# EasyEDA schematic ESP_SCH.json
TITLE: DRONE_ESP_SHIELD; REV: 0.2; Date: 2023-10-10; Sheet: 1/1; Company: QUB
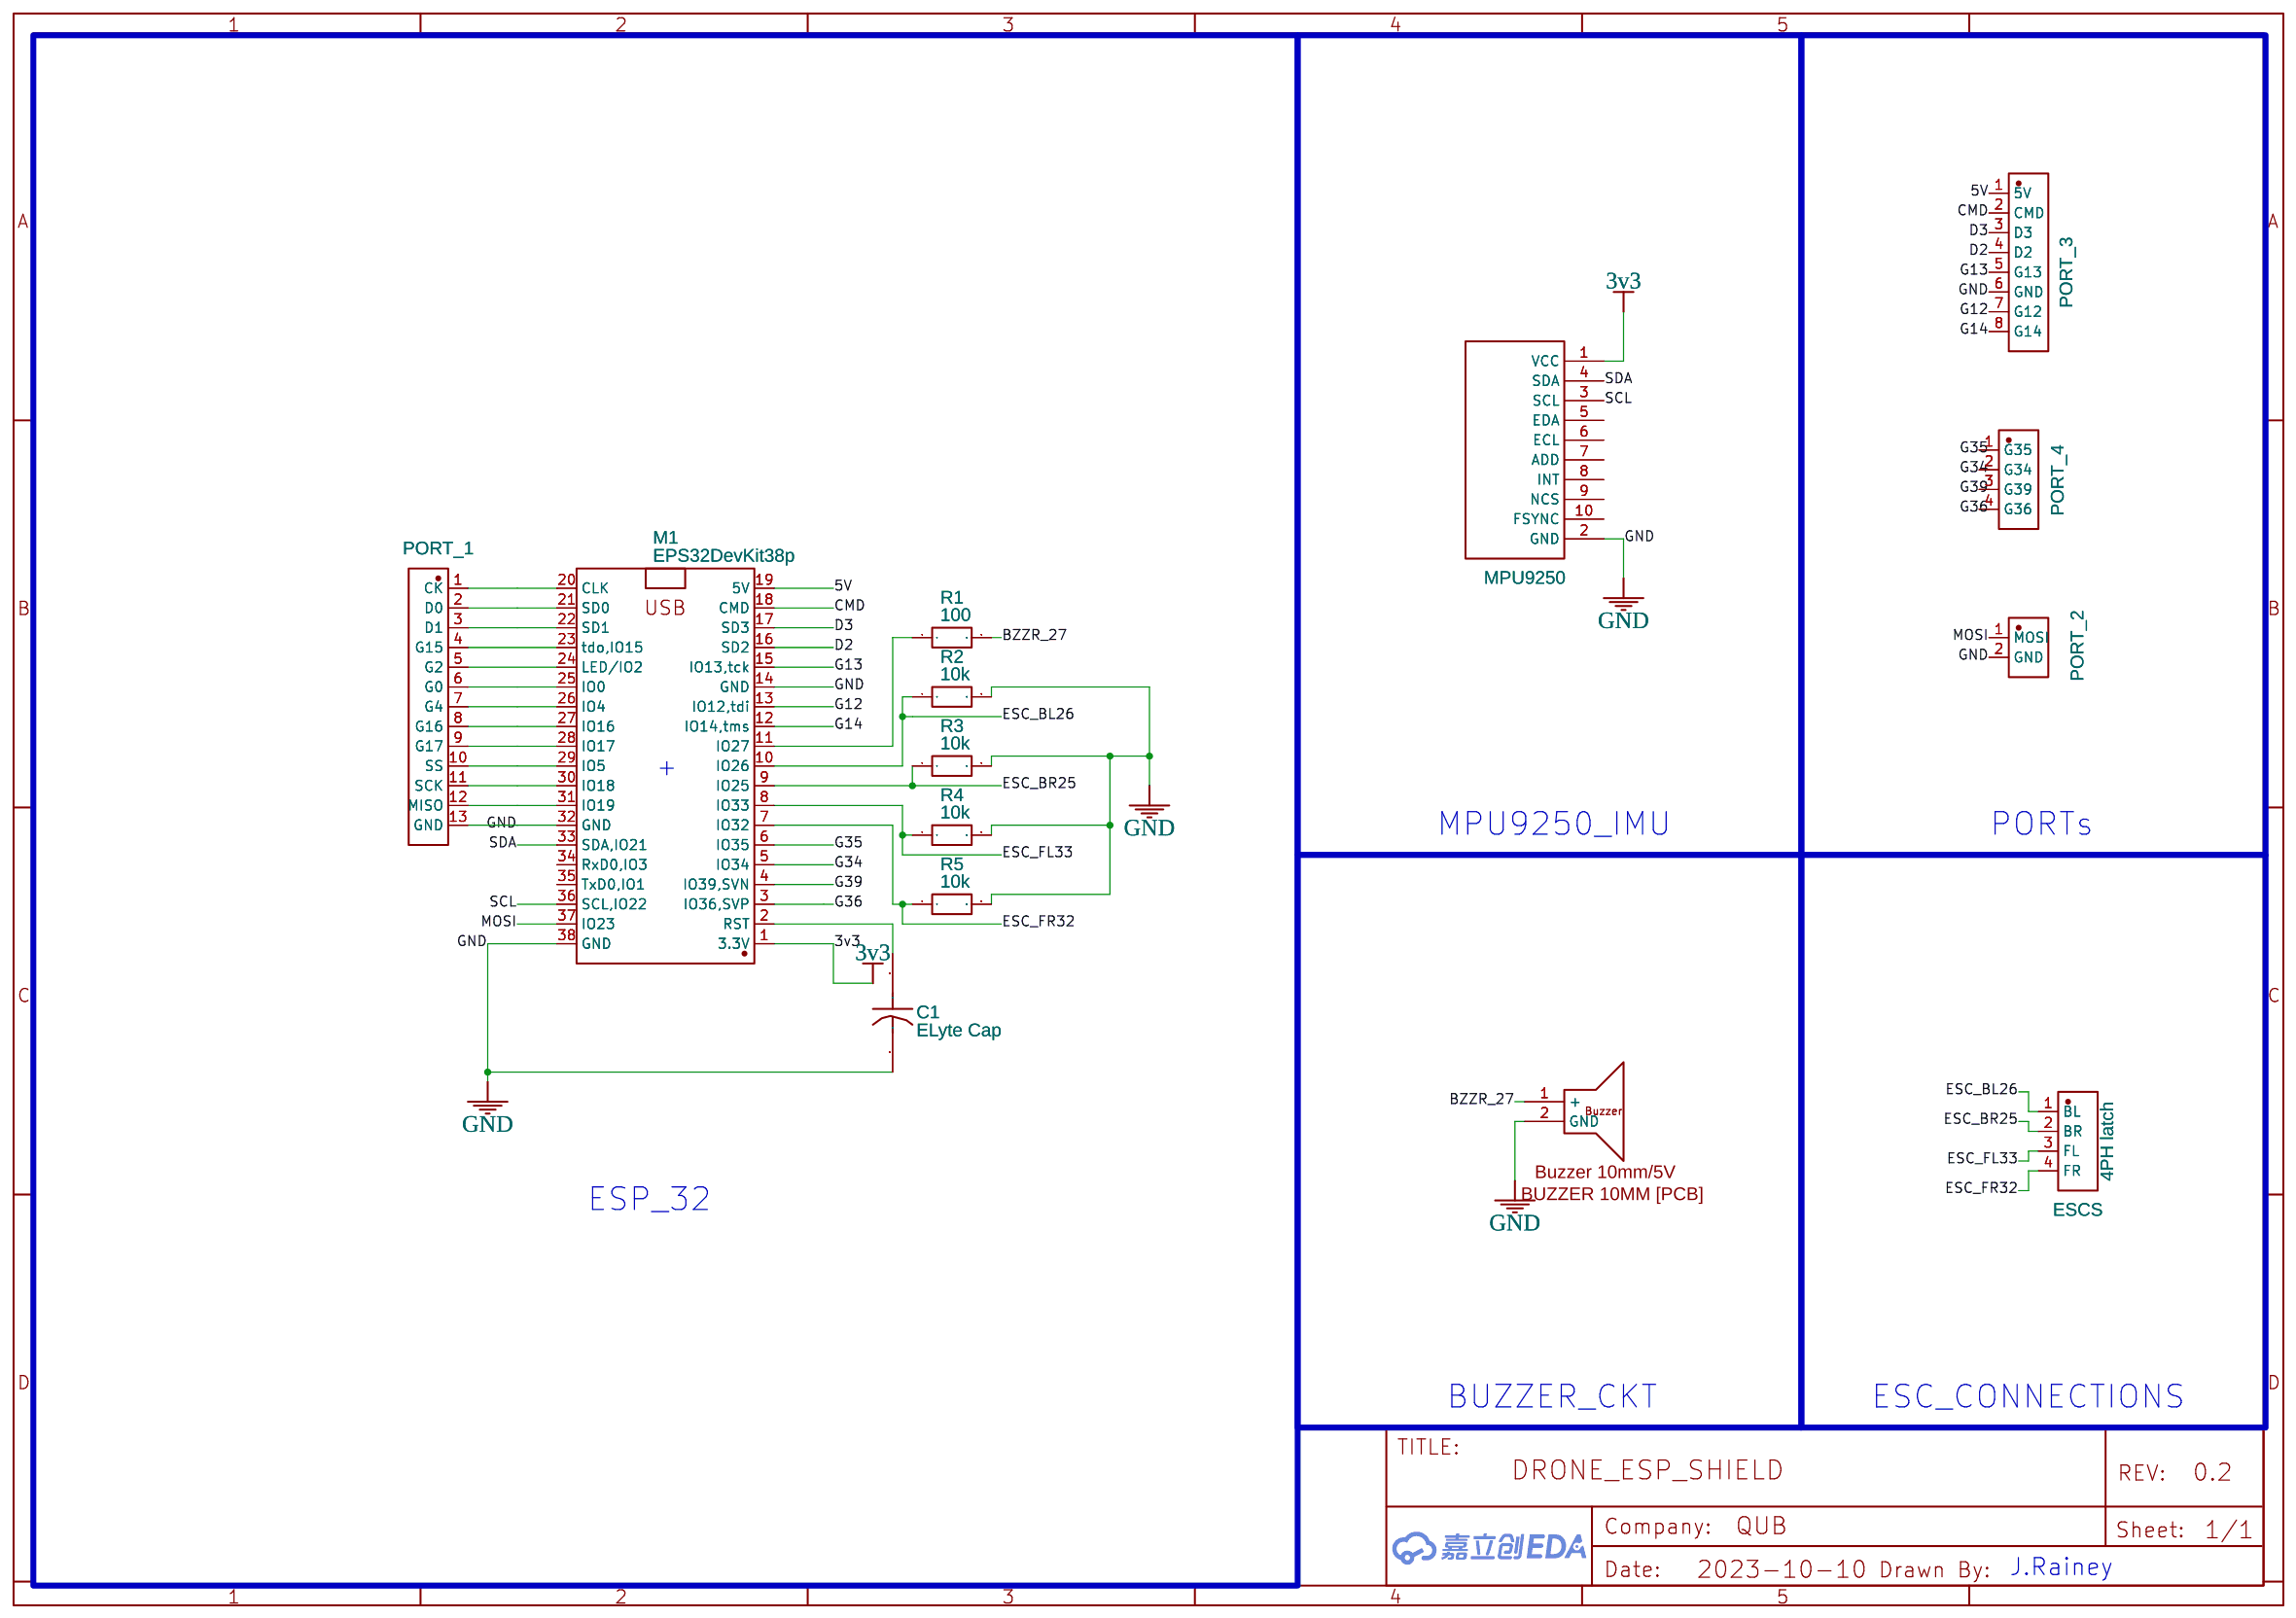
[diagram p0: schematic sheet]

## Parts
BUZZER  Buzzer 10mm/5V  [BUZZER 10MM [PCB]]
C1  ELyte Cap  [ELECTROLITIC CAPACITOR]
ESCS  4PH latch  [HDR-TH_4P-P2.54-V-F]
M1  EPS32DevKit38p  [ESP32DEVKIT38-UNB]
MPU9250  MPU9250  [MPU9250 MODULE]
PORT_1  EXT_PORT  [HDR-TH_13P-P2.54-V-F]
PORT_2  HDR102  [HDR-TH_2P-P2.54-V-M-3]
PORT_3  Port_3  [HDR-TH_8P-P2.54-V-M]
PORT_4  0022285044  [HDR-TH_4P-P2.54-V-M-1]
R1  100  [R_AXIAL-0.4]
R2  10k  [R_AXIAL-0.4]
R3  10k  [R_AXIAL-0.4]
R4  10k  [R_AXIAL-0.4]
R5  10k  [R_AXIAL-0.4]

## Library data of the parts
BUZZER = Buzzer 10mm/5V: Supplier: SHIVRAM; Manufacturer: SHIVRAM; Contributor: Scikraft; Package Display: Yes
C1 = Electrolitic Capacitor: Contributor: dbrancam
ESCS = A2541HWV-4P_C5176037: Supplier: LCSC; Supplier Part: C5176037; Manufacturer: CJT(长江连接器); Manufacturer Part: A2541HWV-4P; link: https://atta.szlcsc.com/upload/public/pdf/source/20220916/7A4096DE70FDAC144DF90D6CBDE9C2A1.pdf; Contributor: lcsc; JLCPCB Part Class: Extended Part
M1 = EPS32DevKit38p: Contributor: unbrainen
MPU9250 = MPU9250 MODULE: Contributor: gnatyuk.yevg
PORT_1 = PZ254-1-13-Z-8.5KK: Supplier: LCSC; Supplier Part: C3012215; Manufacturer: HCTL(华灿天禄); link: https://atta.szlcsc.com/upload/public/pdf/source/20220518/2B6B130E67DEF018154FFE5EFF427855.pdf; Contributor: lcsc
PORT_2 = HDR102: Supplier: LCSC; Supplier Part: C9900001420; Manufacturer: null; JLCPCB Part Class: Extended Part; link: https://item.szlcsc.com/469513.html; Contributor: LCSC
PORT_3 = PZ254-1-08-Z-C: Contributor: lcsc; Supplier: LCSC; Supplier Part: C5156435; Manufacturer: HCTL(华灿天禄)
PORT_4 = 0022285044: Supplier: LCSC; Supplier Part: C9900016049; Manufacturer: null; JLCPCB Part Class: Extended Part; Contributor: lcsc
R1-R5 = R_AXIAL-0.4_EU: Contributor: LCEDA_Lib

## Nets
3v3: M1.1(3.3V) MPU9250.1(VCC)
5V: M1.19(5V) PORT_3.1(5V)
GND: BUZZER.2(GND) C1.2 M1.14(GND) M1.32(GND) M1.38(GND) MPU9250.2(GND) PORT_1.13(GND) PORT_2.2(GND) PORT_3.6(GND) R2.2 R3.2 R4.2 R5.2
BZZR_27: BUZZER.1(+) R1.2
CMD: M1.18(CMD) PORT_3.2(CMD)
D2: M1.16(SD2) PORT_3.4(D2)
D3: M1.17(SD3) PORT_3.3(D3)
ESC_BL26: ESCS.1(BL) M1.10(IO26) R2.1
ESC_BR25: ESCS.2(BR) M1.9(IO25) R3.1
ESC_FL33: ESCS.3(FL) M1.8(IO33) R4.1
ESC_FR32: ESCS.4(FR) M1.7(IO32) R5.1
G12: M1.13(IO12,tdi) PORT_3.7(G12)
G13: M1.15(IO13,tck) PORT_3.5(G13)
G14: M1.12(IO14,tms) PORT_3.8(G14)
G34: M1.5(IO34) PORT_4.2(G34)
G35: M1.6(IO35) PORT_4.1(G35)
G36: M1.3(IO36,SVP) PORT_4.4(G36)
G39: M1.4(IO39,SVN) PORT_4.3(G39)
MOSI: M1.37(IO23) PORT_2.1(MOSI)
SCL: M1.36(SCL,IO22) MPU9250.3(SCL)
SDA: M1.33(SDA,IO21) MPU9250.4(SDA)
Net-(C1-1): C1.1 M1.2(RST)
Net-(M1-11): M1.11(IO27) R1.1
Net-(M1-20): M1.20(CLK) PORT_1.1(CK)
Net-(M1-21): M1.21(SD0) PORT_1.2(D0)
Net-(M1-22): M1.22(SD1) PORT_1.3(D1)
Net-(M1-23): M1.23(tdo,IO15) PORT_1.4(G15)
Net-(M1-24): M1.24(LED/IO2) PORT_1.5(G2)
Net-(M1-25): M1.25(IO0) PORT_1.6(G0)
Net-(M1-26): M1.26(IO4) PORT_1.7(G4)
Net-(M1-27): M1.27(IO16) PORT_1.8(G16)
Net-(M1-28): M1.28(IO17) PORT_1.9(G17)
Net-(M1-29): M1.29(IO5) PORT_1.10(SS)
Net-(M1-30): M1.30(IO18) PORT_1.11(SCK)
Net-(M1-31): M1.31(IO19) PORT_1.12(MISO)

Not connected (* = marked no-connect by the designer): M1 34(RxD0,IO3) 35(TxD0,IO1); MPU9250 5(EDA) 6(ECL) 7(ADD) 8(INT) 9(NCS) 10(FSYNC)

## Notes on the sheet
- +
- MPU9250_IMU
- PORTs
- ESP_32
- BUZZER_CKT
- ESC_CONNECTIONS
- J.Rainey
